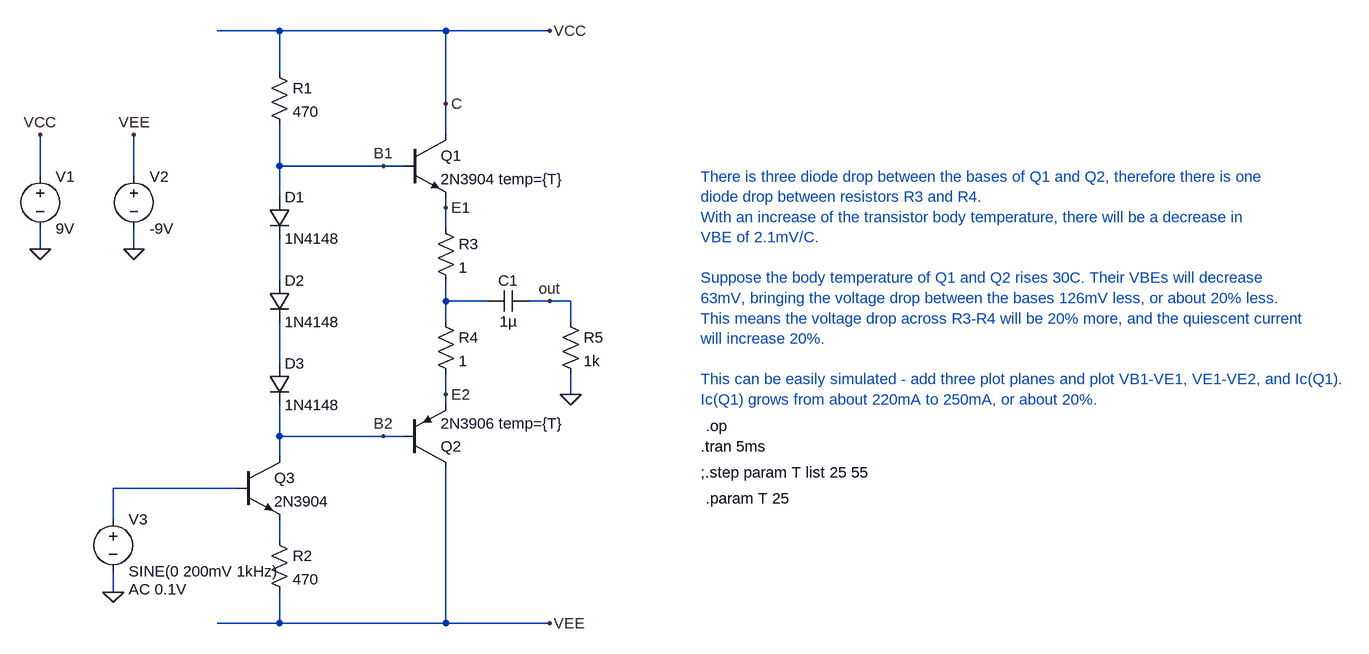
[diagram p0: schematic Figure2.58.asc]
Figure2.58.asc, the LTspice schematic file:
Version 4
SHEET 1 1776 932
WIRE 64 -128 -32 -128
WIRE 320 -128 64 -128
WIRE 480 -128 320 -128
WIRE 64 -64 64 -128
WIRE 320 -16 320 -128
WIRE 320 32 320 -16
WIRE 64 80 64 16
WIRE 224 80 64 80
WIRE 256 80 224 80
WIRE -304 96 -304 32
WIRE -160 96 -160 32
WIRE 64 128 64 80
WIRE 320 144 320 128
WIRE 320 176 320 144
WIRE -304 208 -304 176
WIRE -160 208 -160 176
WIRE 64 256 64 192
WIRE 320 288 320 256
WIRE 384 288 320 288
WIRE 480 288 448 288
WIRE 512 288 480 288
WIRE 320 320 320 288
WIRE 512 320 512 288
WIRE 64 384 64 320
WIRE 320 432 320 400
WIRE 512 432 512 400
WIRE 320 448 320 432
WIRE 64 496 64 448
WIRE 224 496 64 496
WIRE 256 496 224 496
WIRE 64 528 64 496
WIRE 0 576 -192 576
WIRE -192 624 -192 576
WIRE 64 656 64 624
WIRE -192 736 -192 704
WIRE 64 784 64 736
WIRE 64 784 -32 784
WIRE 320 784 320 544
WIRE 320 784 64 784
WIRE 480 784 320 784
FLAG -304 208 0
FLAG -160 208 0
FLAG -304 32 VCC
FLAG -160 32 VEE
FLAG 480 -128 VCC
FLAG 480 784 VEE
FLAG 480 288 out
FLAG 224 80 B1
FLAG 320 144 E1
FLAG 320 -16 C
FLAG 224 496 B2
FLAG 320 432 E2
FLAG -192 736 0
FLAG 512 432 0
SYMBOL diode 48 128 R0
SYMATTR InstName D1
SYMATTR Value 1N4148
SYMBOL diode 48 256 R0
SYMATTR InstName D2
SYMATTR Value 1N4148
SYMBOL diode 48 384 R0
SYMATTR InstName D3
SYMATTR Value 1N4148
SYMBOL res 48 -80 R0
SYMATTR InstName R1
SYMATTR Value 470
SYMBOL voltage -304 80 R0
WINDOW 123 0 0 Left 0
WINDOW 39 0 0 Left 0
SYMATTR InstName V1
SYMATTR Value 9V
SYMBOL voltage -160 80 R0
WINDOW 123 0 0 Left 0
WINDOW 39 0 0 Left 0
SYMATTR InstName V2
SYMATTR Value -9V
SYMBOL npn 256 32 R0
SYMATTR InstName Q1
SYMATTR Value 2N3904 temp={T}
SYMBOL pnp 256 544 M180
SYMATTR InstName Q2
SYMATTR Value 2N3906 temp={T}
SYMBOL voltage -192 608 R0
WINDOW 123 24 124 Left 2
WINDOW 39 0 0 Left 0
SYMATTR Value2 AC 0.1V
SYMATTR InstName V3
SYMATTR Value SINE(0 200mV 1kHz)
SYMBOL npn 0 528 R0
SYMATTR InstName Q3
SYMATTR Value 2N3904
SYMBOL res 48 640 R0
SYMATTR InstName R2
SYMATTR Value 470
SYMBOL res 496 304 R0
SYMATTR InstName R5
SYMATTR Value 1k
SYMBOL res 304 160 R0
SYMATTR InstName R3
SYMATTR Value 1
SYMBOL res 304 304 R0
SYMATTR InstName R4
SYMATTR Value 1
SYMBOL cap 448 272 R90
WINDOW 0 0 32 VBottom 2
WINDOW 3 32 32 VTop 2
SYMATTR InstName C1
SYMATTR Value 1µ
TEXT 720 480 Left 2 !.op
TEXT 712 512 Left 2 !.tran 5ms
TEXT 712 96 Left 2 ;There is three diode drop between the bases of Q1 and Q2, therefore there is one\ndiode drop between resistors R3 and R4. \nWith an increase of the transistor body temperature, there will be a decrease in \nVBE of 2.1mV/C.\n \nSuppose the body temperature of Q1 and Q2 rises 30C. Their VBEs will decrease\n63mV, bringing the voltage drop between the bases 126mV less, or about 20% less.\nThis means the voltage drop across R3-R4 will be 20% more, and the quiescent current\nwill increase 20%.\n \nThis can be easily simulated - add three plot planes and plot VB1-VE1, VE1-VE2, and Ic(Q1).\nIc(Q1) grows from about 220mA to 250mA, or about 20%.
TEXT 712 552 Left 2 !;.step param T list 25 55
TEXT 720 592 Left 2 !.param T 25

The netlist it stands for:
* Figure2.58.asc
D1 B1 N001 1N4148
D2 N001 N003 1N4148
D3 N003 B2 1N4148
R1 C B1 470
V1 C 0 9V
V2 VEE 0 -9V
Q1 C B1 E1 0 2N3904 temp={T}
Q2 VEE B2 E2 0 2N3906 temp={T}
V3 N004 0 SINE(0 200mV 1kHz) AC 0.1V
Q3 B2 N004 N005 0 2N3904
R2 N005 VEE 470
R5 out 0 1k
R3 E1 N002 1
R4 N002 E2 1
C1 out N002 1µ
.model D D
.lib standard.dio
.model NPN NPN
.model PNP PNP
.lib standard.bjt
.op
.tran 5ms
* There is three diode drop between the bases of Q1 and Q2, therefore there is one
* diode drop between resistors R3 and R4.
* With an increase of the transistor body temperature, there will be a decrease in
* VBE of 2.1mV/C.
* Suppose the body temperature of Q1 and Q2 rises 30C. Their VBEs will decrease
* 63mV, bringing the voltage drop between the bases 126mV less, or about 20% less.
* This means the voltage drop across R3-R4 will be 20% more, and the quiescent current
* will increase 20%.
* This can be easily simulated - add three plot planes and plot VB1-VE1, VE1-VE2, and Ic(Q1).
* Ic(Q1) grows from about 220mA to 250mA, or about 20%.
;.step param T list 25 55
.param T 25
.backanno
.end